# EAGLE schematic BlinkingLEDs (EAGLE 9.6.2)
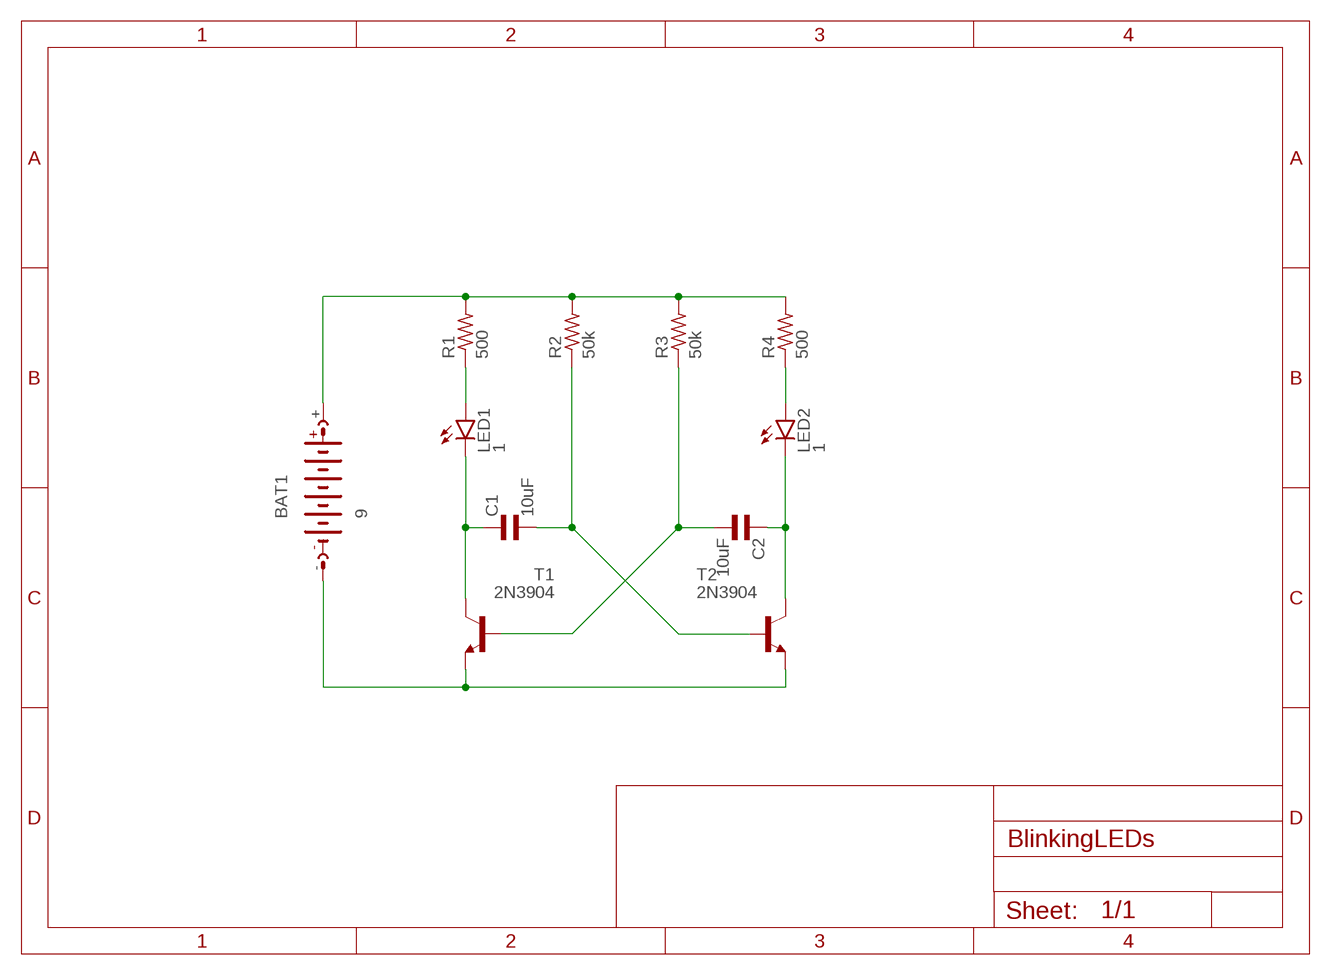
[diagram p0: schematic, sheet 1]

## Parts
BAT1  9  AB9V  [AB9V]
C1  10uF  EL-BI25-10AXIAL  [EU25-10]
C2  10uF  EL-BI25-10AXIAL  [EU25-10]
LED1  1  LED5MM  [LED5MM]
LED2  1  LED5MM  [LED5MM]
R1  500  R-US_0204/7  [0204/7]
R2  50k  R-US_0204/7  [0204/7]
R3  50k  R-US_0204/7  [0204/7]
R4  500  R-US_0204/7  [0204/7]
T1  2N3904  [TO92]
T2  2N3904  [TO92]

## Nets
N$1: BAT1.+ R1.2 R2.2 R3.2 R4.2
N$2: LED2.A R4.1
N$3: LED1.A R1.1
N$4: C1.1 LED1.K(C) T1.1(C)
N$5: C1.2 R2.1 T2.2(B)
N$6: C2.2 R3.1 T1.2(B)
N$7: C2.1 LED2.K(C) T2.1(C)
N$8: BAT1.- T1.3(E) T2.3(E)

## Library data of the parts
BAT1 = battery:AB9V: 9-V BATTERY CLIP
C1 C2 = rcl:EL-: BIPOLAR ELECTROLYTIC CAPACITOR; SPICEPREFIX: C
LED1 LED2 = led:LED: LED OSRAM: - CHIPLED LG R971, LG N971, LY N971, LG Q971, LY Q971, LO R971, LY R971 LH N974, LH R974 LS Q976, LO Q976, LY Q976 LO Q996 - Hyper CHIPLED LW Q18S LB Q993, LB Q99A, LB R99A - SideLED LS A670, LO A670, LY A670, LG A670, LP A670 LB A673, LV A673, LT A673, LW A673 LH A674 LY A675 LS A676, LA A676, LO A676, LY A676, LW A676 LS A679, LY A679, LG A679 - Hyper Micro SIDELED® LS Y876, LA Y876, LO Y876, LY Y876 LT Y87S - SmartLED LW L88C, LW L88S LB L89C, LB L89S, LG L890 LS L89K, LO L89K, LY L89K LS L896, LA L896, LO L896, LY L896 - TOPLED LS T670, LO T670, LY T670, LG T670, LP T670 LSG T670, LSP T670, LSY T670, LOP T670, LYG T670 LG T671, LOG T671, LSG T671 LB T673, LV T673, LT T673, LW T673 LH T674 LS T676, LA T676, LO T676, LY T676, LB T676, LH T676, LSB T676, LW T676 LB T67C, LV T67C, LT T67C, LS T67K, LO T67K, LY T67K, LW E67C LS E67B, LA E67B, LO E67B, LY E67B, LB E67C, LV E67C, LT E67C LW T67C LS T679, LY T679, LG T679 LS T770, LO T770, LY T770, LG T770, LP T770 LB T773, LV T773, LT T773, LW T773 LH T774 LS E675, LA E675, LY E675, LS T675 LS T776, LA T776, LO T776, LY T776, LB T776 LHGB T686 LT T68C, LB T68C - Hyper Mini TOPLED® LB M676 - Mini TOPLED Santana® LG M470 LS M47K, LO M47K, LY M47K Source: http://www.osram.convergy.de LUXEON: - LUMILED® LXK2-PW12-R00, LXK2-PW12-S00, LXK2-PW14-U00, LXK2-PW14-V00 LXK2-PM12-R00, LXK2-PM12-S00, LXK2-PM14-U00 LXK2-PE12-Q00, LXK2-PE12-R00, LXK2-PE12-S00, LXK2-PE14-T00, LXK2-PE14-U00 LXK2-PB12-K00, LXK2-PB12-L00, LXK2-PB12-M00, LXK2-PB14-N00, LXK2-PB14-P00, LXK2-PB14-Q00 LXK2-PR12-L00, LXK2-PR12-M00, LXK2-PR14-Q00, LXK2-PR14-R00 LXK2-PD12-Q00, LXK2-PD12-R00, LXK2-PD12-S00 LXK2-PH12-R00, LXK2-PH12-S00 LXK2-PL12-P00, LXK2-PL12-Q00, LXK2-PL12-R00 Source: www.luxeon.com KINGBRIGHT: KA-3528ASYC Source: www.kingbright.com
R1-R4 = rcl:R-US_: RESISTOR, American symbol; SPICEPREFIX: R
T1 T2 = transistor:2N3904: NPN TRANSISTOR